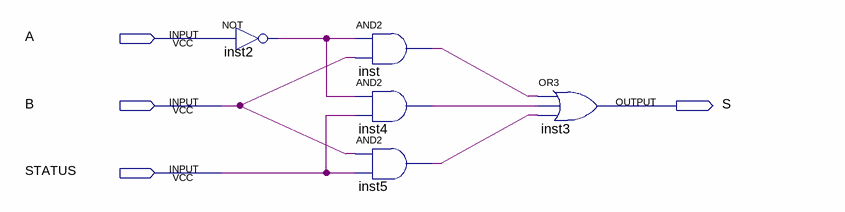
[diagram p0: schematic sheet]
// Quartus schematic module_msb_bigger_than.bdf as structural Verilog: 5 symbols, 4 pins
module module_msb_bigger_than (
  input  A,
  input  B,
  input  STATUS,
  output S
);

  wire inst2_out, inst4_out, inst5_out, inst_out;

  not inst2 (inst2_out, A);
  and inst (inst_out, inst2_out, B);
  and inst4 (inst4_out, inst2_out, STATUS);
  and inst5 (inst5_out, B, STATUS);
  or inst3 (S, inst_out, inst4_out, inst5_out);
endmodule
